# Altium schematic sheet Схема сборки_without_temp_border.SchDoc
size 420 x 297 mm; Address1: Address1; Address2: Address2; Address3: Address3; Address4: Address4; DocumentNumber: АБВГ.123456.001 Э3; SheetNumber: 2; SheetTotal: 5; Scale: 1:1; DocumentType: Схема электрическая принципиальная; FirstReferrence: АБВГ.123456.001
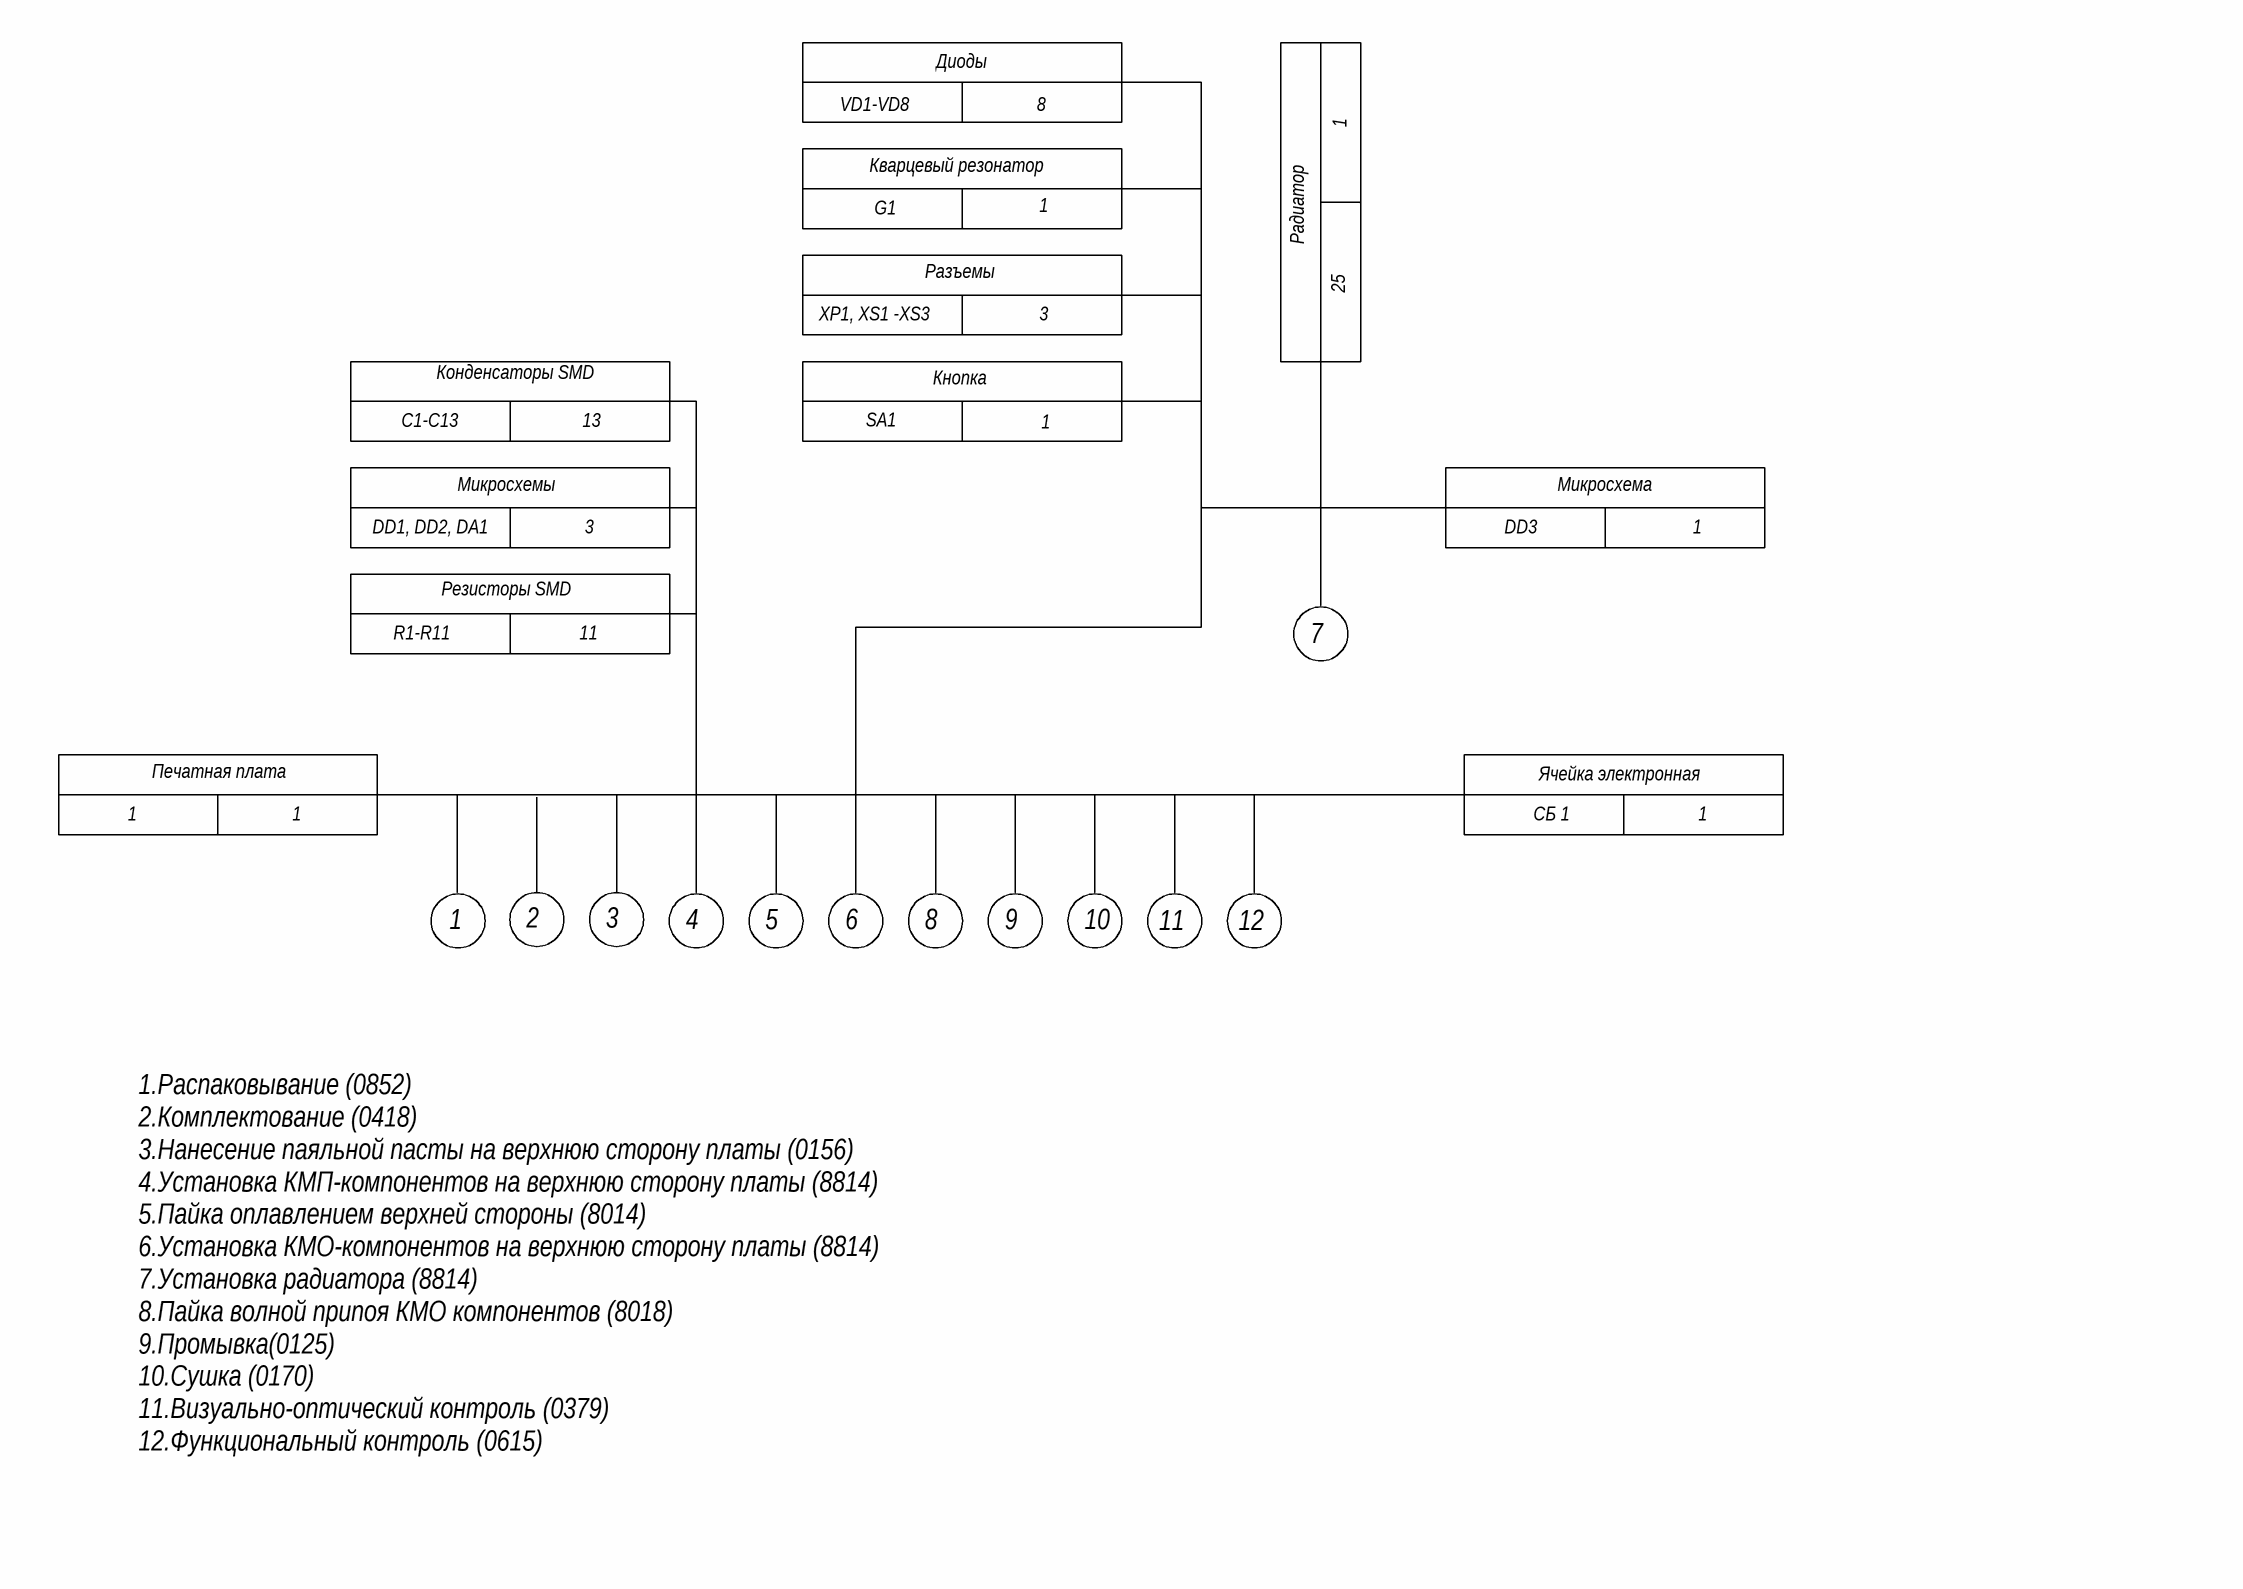
[diagram p0: Схема сборки_without_temp_border.SchDoc]

## Notes on the sheet
- VD1-VD8
- Диоды
- 8
- 1
- Кварцевый резонатор
- G1
- Радиатор
- XP1, XS1 -XS3
- Разъемы
- 3
- 25
- Конденсаторы SMD
- Кнопка
- C1-C13
- 13
- SA1
- Микросхемы
- Микросхема
- DD1, DD2, DA1
- Резисторы SMD
- DD3
- R1-R11
- 11
- 7
- Печатная плата
- Ячейка электронная
- СБ 1
- 2
- 4
- 5
- 6
- 9
- 10
- 12
- 1.Распаковывание (0852)
  2.Комплектование (0418)
  3.Нанесение паяльной пасты на верхнюю сторону платы (0156)
  4.Установка КМП-компонентов на верхнюю сторону платы (8814)
  5.Пайка оплавлением верхней стороны (8014)
  6.Установка КМО-компонентов на верхнюю сторону платы (8814)
  7.Установка радиатора (8814)
  8.Пайка волной припоя КМО компонентов (8018)
  9.Промывка(0125)
  10.Сушка (0170)
  11.Визуально-оптический контроль (0379)
  12.Функциональный контроль (0615)